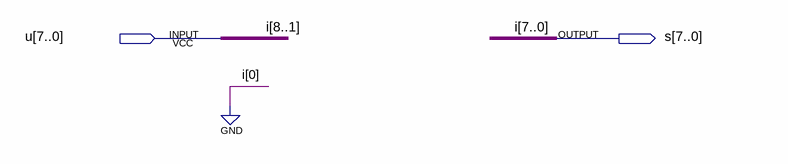
[diagram p0: schematic sheet]
// Quartus schematic SL1bit.bdf as structural Verilog: 0 symbols, 2 pins
module SL1bit (
  input  [7:0] u,
  output [7:0] s
);


  assign s = {u[6:0], 1'b0};

  // Other names for the same wires on the sheet: i[8:1] = u
endmodule
